# Altium schematic sheet Block Diagram.SchDoc
size A3; SheetNumber: 2; SheetTotal: 2
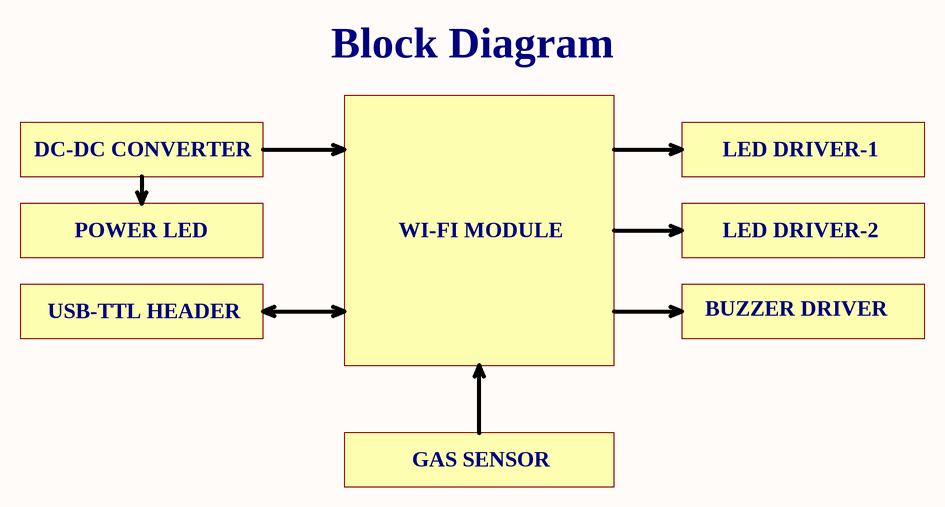
[diagram p0: Block Diagram.SchDoc]

## Notes on the sheet
- Block Diagram
- DC-DC CONVERTER
- LED DRIVER-1
- POWER LED
- WI-FI MODULE
- LED DRIVER-2
- USB-TTL HEADER
- BUZZER DRIVER
- GAS SENSOR
- Dosya Adı / File Name
- Hazırlayan / Prepared By
- Tanım / Description
- Değiştirme Tarihi / Changed Date
- Bölüm / Department
- Onaylayan / Approved By
- Kontrol Eden / Checked By
- Boyut / Size
- Sayfa / Sheet
- Revizyon / Revision